# EAGLE design midle_led (EAGLE 9.6.2)
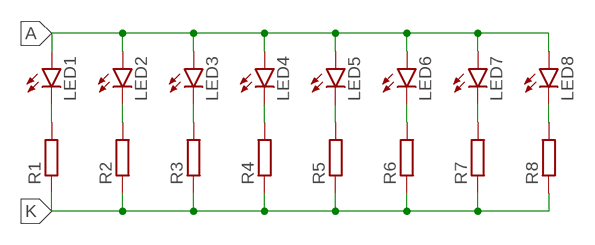
[diagram p0: schematic, sheet 1]

## Parts
LED1  LED5MM  [LED5MM]
LED2  LED5MM  [LED5MM]
LED3  LED5MM  [LED5MM]
LED4  LED5MM  [LED5MM]
LED5  LED5MM  [LED5MM]
LED6  LED5MM  [LED5MM]
LED7  LED5MM  [LED5MM]
LED8  LED5MM  [LED5MM]
R1  R-EU_R0603  [R0603]
R2  R-EU_R0603  [R0603]
R3  R-EU_R0603  [R0603]
R4  R-EU_R0603  [R0603]
R5  R-EU_R0603  [R0603]
R6  R-EU_R0603  [R0603]
R7  R-EU_R0603  [R0603]
R8  R-EU_R0603  [R0603]

## Nets
A: LED1.A LED2.A LED3.A LED4.A LED5.A LED6.A LED7.A LED8.A
K: R1.1 R2.1 R3.1 R4.1 R5.1 R6.1 R7.1 R8.1
N$1: LED1.K(C) R1.2
N$2: LED2.K(C) R2.2
N$3: LED3.K(C) R3.2
N$4: LED4.K(C) R4.2
N$5: LED5.K(C) R5.2
N$6: LED6.K(C) R6.2
N$7: LED7.K(C) R7.2
N$8: LED8.K(C) R8.2

## Library data of the parts
LED1-LED8 = led:LED: LED OSRAM: - CHIPLED LG R971, LG N971, LY N971, LG Q971, LY Q971, LO R971, LY R971 LH N974, LH R974 LS Q976, LO Q976, LY Q976 LO Q996 - Hyper CHIPLED LW Q18S LB Q993, LB Q99A, LB R99A - SideLED LS A670, LO A670, LY A670, LG A670, LP A670 LB A673, LV A673, LT A673, LW A673 LH A674 LY A675 LS A676, LA A676, LO A676, LY A676, LW A676 LS A679, LY A679, LG A679 - Hyper Micro SIDELED® LS Y876, LA Y876, LO Y876, LY Y876 LT Y87S - SmartLED LW L88C, LW L88S LB L89C, LB L89S, LG L890 LS L89K, LO L89K, LY L89K LS L896, LA L896, LO L896, LY L896 - TOPLED LS T670, LO T670, LY T670, LG T670, LP T670 LSG T670, LSP T670, LSY T670, LOP T670, LYG T670 LG T671, LOG T671, LSG T671 LB T673, LV T673, LT T673, LW T673 LH T674 LS T676, LA T676, LO T676, LY T676, LB T676, LH T676, LSB T676, LW T676 LB T67C, LV T67C, LT T67C, LS T67K, LO T67K, LY T67K, LW E67C LS E67B, LA E67B, LO E67B, LY E67B, LB E67C, LV E67C, LT E67C LW T67C LS T679, LY T679, LG T679 LS T770, LO T770, LY T770, LG T770, LP T770 LB T773, LV T773, LT T773, LW T773 LH T774 LS E675, LA E675, LY E675, LS T675 LS T776, LA T776, LO T776, LY T776, LB T776 LHGB T686 LT T68C, LB T68C - Hyper Mini TOPLED® LB M676 - Mini TOPLED Santana® LG M470 LS M47K, LO M47K, LY M47K Source: http://www.osram.convergy.de LUXEON: - LUMILED® LXK2-PW12-R00, LXK2-PW12-S00, LXK2-PW14-U00, LXK2-PW14-V00 LXK2-PM12-R00, LXK2-PM12-S00, LXK2-PM14-U00 LXK2-PE12-Q00, LXK2-PE12-R00, LXK2-PE12-S00, LXK2-PE14-T00, LXK2-PE14-U00 LXK2-PB12-K00, LXK2-PB12-L00, LXK2-PB12-M00, LXK2-PB14-N00, LXK2-PB14-P00, LXK2-PB14-Q00 LXK2-PR12-L00, LXK2-PR12-M00, LXK2-PR14-Q00, LXK2-PR14-R00 LXK2-PD12-Q00, LXK2-PD12-R00, LXK2-PD12-S00 LXK2-PH12-R00, LXK2-PH12-S00 LXK2-PL12-P00, LXK2-PL12-Q00, LXK2-PL12-R00 Source: www.luxeon.com KINGBRIGHT: KA-3528ASYC Source: www.kingbright.com
R1-R8 = rcl:R-EU_: RESISTOR, European symbol; SPICEPREFIX: R

## Board
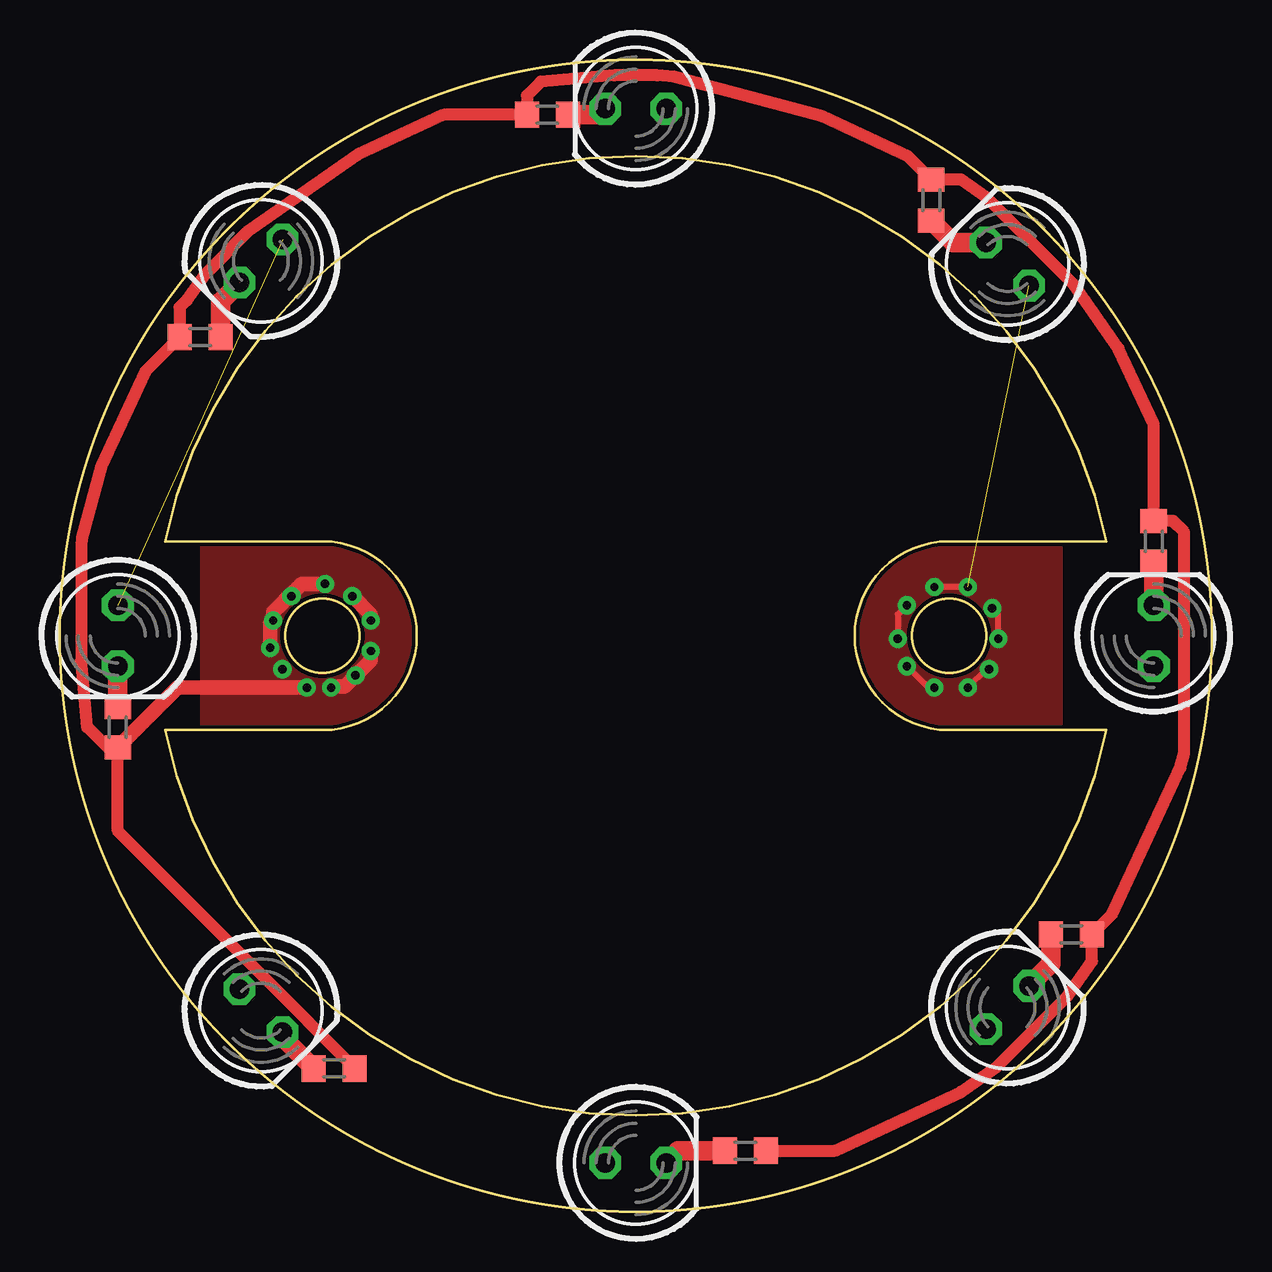
[diagram p1: board, top side]
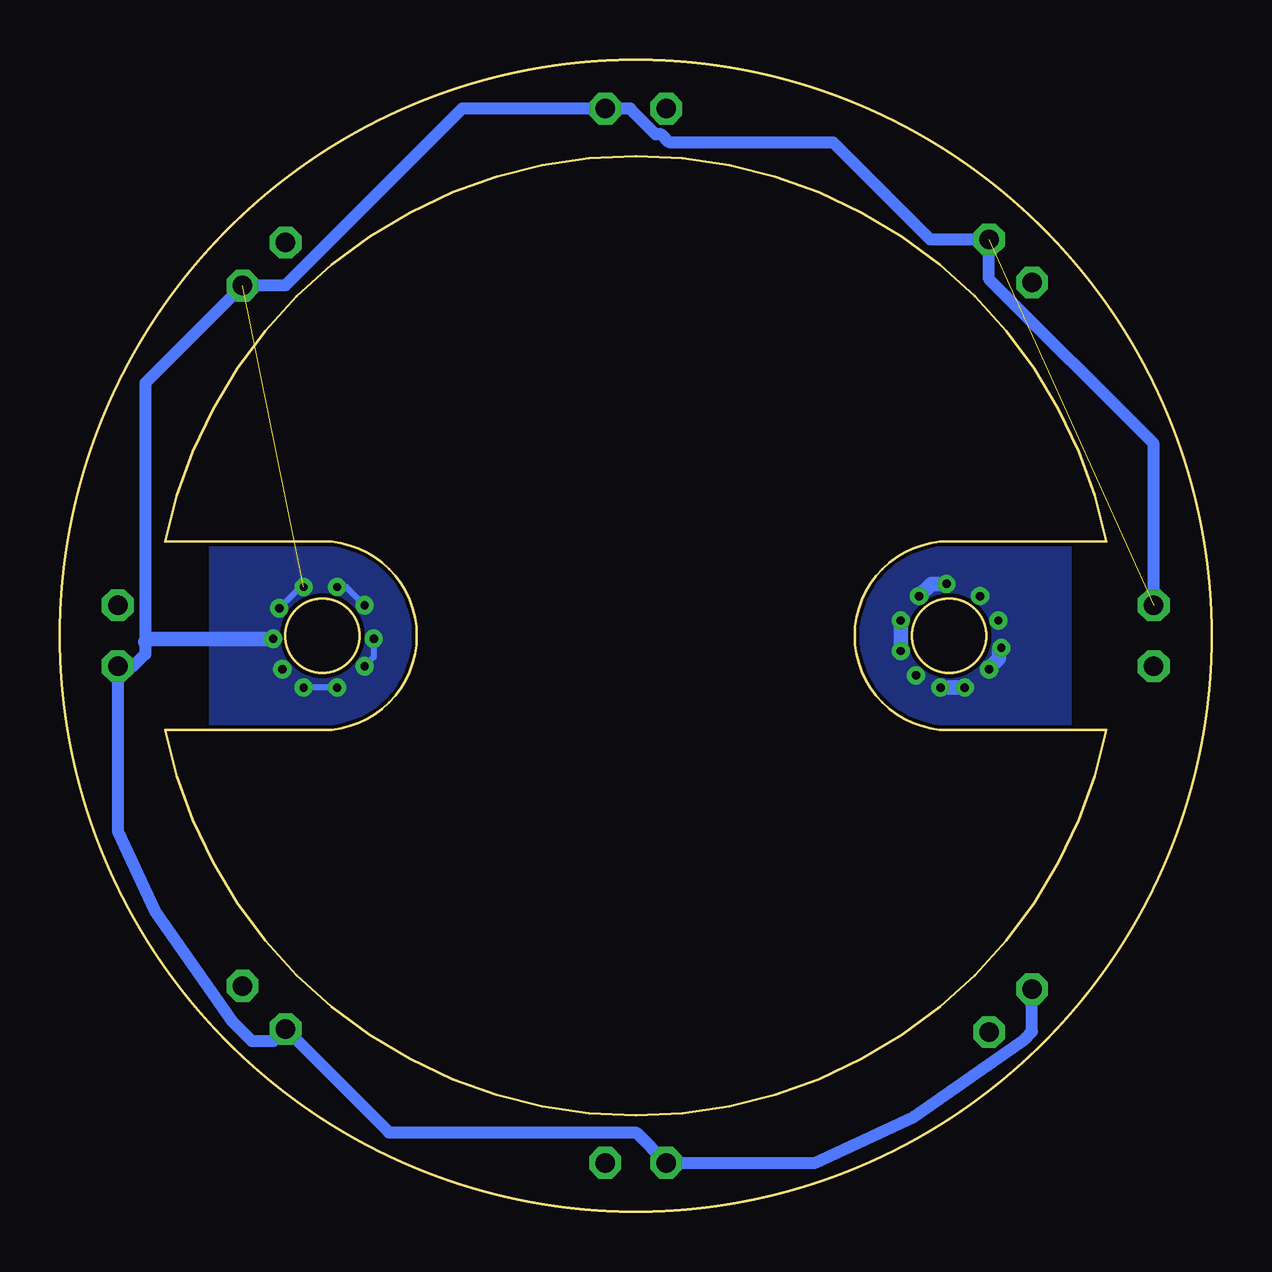
[diagram p2: board, bottom side, seen from below]

Size 48 x 48 mm. Coordinates in mm from the lower left corner, seen from the top.
Outline: 37.06,27.94 arc180 37.06,20.06 43.61,20.06 arc-157 4.39,20.06 10.94,20.06 arc180 10.94,27.94 4.39,27.94 arc-157 43.61,27.94 37.06,27.94
Outline: circle at 10.94,24 radius 1.55
Outline: circle at 37.06,24 radius 1.55
Outline: circle at 24,24 radius 24
Copper layers (1*16): Top 0.035mm / dielectric 1.5mm / Bottom 0.035mm
Design rules "default *": minimum track width 6mil, minimum drill 0.35mm, track to track 6mil, track to pad 6mil, pad to pad 6mil, via to via 6mil, smd to smd 6mil, copper to edge 6mil, drill to drill 6mil, minimum pad ring 10mil, minimum via ring 8mil, stop-mask expansion 4mil, vias tented up to drill 0mil, thermal gap 10mil

### Footprints (pad centres in the part's own frame; a part is rotated, then mirrored left to right if it is on the bottom)
LED5MM = drill 0.813 octagon: A -1.27,0; K 1.27,0
R0603 = smd 1 x 1.1: 1 -0.85,0; 2 0.85,0

### Placement (x,y rotation side)
LED1  24,2.03 0 top
LED2  39.49,8.51 45 top
LED3  45.59,24 90 top
LED4  39.49,39.49 135 top
LED5  24,45.97 180 top
LED6  8.38,39.62 225 top
LED7  2.41,24 270 top
LED8  8.38,8.38 315 top
R1  28.57,2.54 180 top
R2  42.16,11.55 180 top
R3  45.59,27.94 270 top
R4  36.32,42.16 270 top
R5  20.32,45.72 0 top
R6  5.84,36.45 0 top
R7  2.41,20.19 90 top
R8  11.43,5.97 180 top

### Tracks (layer width: path | path; a pad name or v marks a point on that pad's centre or on a via)
A  (via drill 0.35)  (2 unrouted)
  Top 0.254: v39.11,23.87 39.11,24.89 v38.86,25.14 | v37.84,26.03 v36.45,26.03 | v35.3,25.27 34.92,24.89 v34.92,23.87 | v35.3,22.73 36.19,21.84 v36.45,21.84 | v37.84,21.84 38.61,22.6 v38.73,22.6
  Bottom 0.254: 44.45,23.75 39.24,23.75 v39.11,23.87 | v38.86,25.14 37.97,26.03 v37.84,26.03 | v36.45,26.03 36.06,26.03 v35.3,25.27 | v34.92,23.87 34.92,23.11 v35.3,22.73 | v36.45,21.84 v37.84,21.84
  Bottom 0.508: LED7.A 2.41,32 9.28,38.87 LED6.A 11.72,40.52 15.76,44.56 22.59,44.56 22.93,44.9 23.17,44.9 24.24,45.97 LED5.A 31.24,45.97 38.61,38.6 LED4.A 44.45,34.54 44.45,23.75 44.45,23.24 44.95,22.73 LED3.A 45.59,15.84 44.05,12.53 40.83,7.93 40,7.11 39.09,7.11 LED2.A 34.29,3.3 24,3.3 LED1.A 16.53,2.03 12.41,3.95 7.79,7.19 7.48,7.49 LED8.A
  Bottom 0.61: v39.11,23.87 44.32,23.87 44.45,23.75
  pour Top: 41.65,28.19 41.65,19.68 34.54,19.68 32.38,21.84 32.38,25.78 34.67,28.06 34.8,28.19
  pour Bottom: 41.65,19.68 41.65,28.19 34.54,28.19 32.38,26.03 32.38,22.09 34.67,19.81 34.8,19.68
K  (via drill 0.35)
  Top 0.508: R1.1 32.3,2.54 37.57,4.99 39.05,6.03 41.97,8.95 43.01,10.44 R2.1 43.86,12.4 46.7,18.5 46.86,19.09 46.86,28.32 46.39,28.79 R3.1 45.59,32.83 44.12,35.97 42.27,38.62 38.62,42.27 37.56,43.01 R4.1 35.36,43.97 31.76,45.65 25.58,47.3 24.89,47.36 23.11,47.36 20.05,47.1 19.47,46.52 R5.1 15.99,45.72 12.41,44.05 7.79,40.81 6.04,39.07 5.29,37.99 4.99,37.69 R6.1 3.55,35.01 1.72,31.08 0.91,28.07 0.89,27.75 0.89,23.03 1.13,20.2 1.99,19.34 R7.1 2.41,15.86 10.34,7.92 10.34,7.9 R8.1
  Top 0.61: R7.1 4.91,21.84 v10.28,21.84 | v11.3,21.84 11.34,21.88 11.86,21.88 12.95,22.97 v12.95,23.36 | v12.95,24.64 12.95,24.89 v12.19,25.65 | v11.05,26.16 10.06,26.16 9.61,25.7 9.4,25.53 9.23,25.33 8.89,24.98 8.89,24.68 8.87,24.64 8.76,24.53 v8.76,23.49
  Bottom 0.61: v10.28,21.84 v11.3,21.84 | v12.95,23.36 v12.95,24.64 | v12.19,25.65 11.68,26.16 v11.05,26.16 | v8.76,23.49 8.86,23.39 8.86,23.06 9.16,22.76 9.27,22.63 v9.27,22.6
  other vias: 12.32,22.35 9.65,25.65 8.89,24.64
  pour Top: 5.97,19.68 5.97,28.19 13.08,28.19 15.24,26.03 15.24,22.09 12.95,19.81 12.82,19.68
  pour Bottom: 5.97,28.19 5.97,19.68 13.08,19.68 15.24,21.84 15.24,25.78 12.95,28.06 12.82,28.19
N$1
  Top 0.813: R1.2 25.9,2.54 25.89,2.53 25.77,2.53 LED1.K
N$2
  Top 0.813: R2.2 41.31,10.32 LED2.K
N$3
  Top 0.813: R3.2 LED3.K
N$4  (1 unrouted)
  Top 0.813: LED4.K 37.24,40.39 R4.2
N$5
  Top 0.813: R5.2 22.48,45.72 LED5.K
N$6  (1 unrouted)
  Top 0.813: R6.2 6.69,37.93 LED6.K
N$7
  Top 0.813: R7.2 LED7.K
N$8
  Top 0.813: R8.2 9.28,7.27 LED8.K